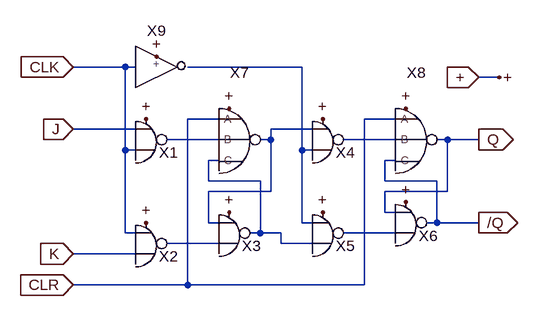
[diagram p0: schematic Jonsson.asc]
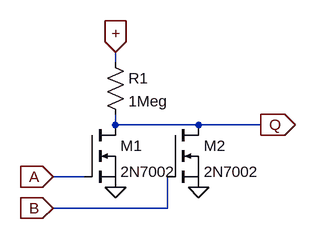
[diagram p1: sub-circuit nor2.asc]
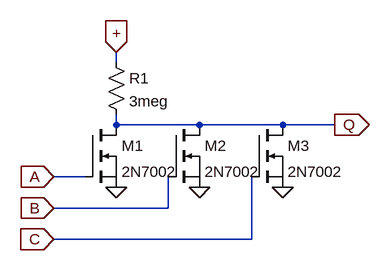
[diagram p2: sub-circuit nor3.asc]
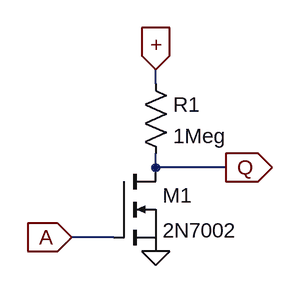
[diagram p3: sub-circuit inv.asc]
Jonsson.asc, the LTspice schematic file:
Version 4
SHEET 1 880 680
WIRE 176 80 96 80
WIRE 192 80 176 80
WIRE 448 80 272 80
WIRE 752 96 720 96
WIRE 320 160 272 160
WIRE 592 160 544 160
WIRE 192 176 96 176
WIRE 464 176 400 176
WIRE 320 192 240 192
WIRE 400 192 400 176
WIRE 400 192 384 192
WIRE 592 192 512 192
WIRE 672 192 656 192
WIRE 720 192 672 192
WIRE 176 208 176 80
WIRE 192 208 176 208
WIRE 448 208 448 80
WIRE 464 208 448 208
WIRE 320 224 304 224
WIRE 592 224 576 224
WIRE 304 256 304 224
WIRE 384 256 304 256
WIRE 576 256 576 224
WIRE 656 256 576 256
WIRE 400 272 400 192
WIRE 400 272 304 272
WIRE 672 272 672 192
WIRE 672 272 576 272
WIRE 576 304 576 272
WIRE 592 304 576 304
WIRE 304 320 304 272
WIRE 320 320 304 320
WIRE 448 320 448 208
WIRE 464 320 448 320
WIRE 656 320 656 256
WIRE 656 320 640 320
WIRE 720 320 656 320
WIRE 176 336 176 208
WIRE 192 336 176 336
WIRE 384 336 384 256
WIRE 384 336 368 336
WIRE 416 336 384 336
WIRE 592 336 512 336
WIRE 320 352 240 352
WIRE 416 352 416 336
WIRE 464 352 416 352
WIRE 192 368 96 368
WIRE 272 416 272 160
WIRE 272 416 96 416
WIRE 544 416 544 160
WIRE 544 416 272 416
FLAG 224 64 +
FLAG 208 160 +
FLAG 208 320 +
FLAG 336 304 +
FLAG 336 144 +
FLAG 480 160 +
FLAG 480 304 +
FLAG 608 288 +
FLAG 608 144 +
FLAG 96 80 CLK
IOPIN 96 80 In
FLAG 96 176 J
IOPIN 96 176 In
FLAG 96 368 K
IOPIN 96 368 In
FLAG 96 416 CLR
IOPIN 96 416 In
FLAG 720 192 Q
IOPIN 720 192 Out
FLAG 720 320 /Q
IOPIN 720 320 Out
FLAG 720 96 +
IOPIN 720 96 In
FLAG 752 96 +
SYMBOL NOR2 224 192 R0
SYMATTR InstName X1
SYMBOL NOR2 224 352 R0
SYMATTR InstName X2
SYMBOL NOR2 352 336 R0
SYMATTR InstName X3
SYMBOL NOR2 496 192 R0
SYMATTR InstName X4
SYMBOL NOR2 496 336 R0
SYMATTR InstName X5
SYMBOL NOR2 624 320 R0
SYMATTR InstName X6
SYMBOL NOR3 352 192 R0
SYMATTR InstName X7
SYMBOL NOR3 624 192 R0
SYMATTR InstName X8
SYMBOL INV 224 80 R0
SYMATTR InstName X9

nor2.asc, the sub-circuit schematic file:
Version 4
SHEET 1 880 680
WIRE 272 144 272 128
WIRE 272 240 272 224
WIRE 400 240 272 240
WIRE 496 240 400 240
WIRE 224 320 176 320
WIRE 352 368 352 320
WIRE 352 368 176 368
FLAG 272 336 0
FLAG 176 320 A
IOPIN 176 320 In
FLAG 496 240 Q
IOPIN 496 240 Out
FLAG 272 128 +
IOPIN 272 128 In
FLAG 400 336 0
FLAG 176 368 B
IOPIN 176 368 In
SYMBOL nmos 224 240 R0
SYMATTR InstName M1
SYMATTR Value 2N7002
SYMBOL res 256 128 R0
SYMATTR InstName R1
SYMATTR Value 1Meg
SYMBOL nmos 352 240 R0
SYMATTR InstName M2
SYMATTR Value 2N7002

nor3.asc, the sub-circuit schematic file:
Version 4
SHEET 1 880 680
WIRE 272 144 272 128
WIRE 272 240 272 224
WIRE 400 240 272 240
WIRE 528 240 400 240
WIRE 608 240 528 240
WIRE 224 320 176 320
WIRE 352 368 352 320
WIRE 352 368 176 368
WIRE 480 416 480 320
WIRE 480 416 176 416
FLAG 272 336 0
FLAG 176 320 A
IOPIN 176 320 In
FLAG 608 240 Q
IOPIN 608 240 Out
FLAG 272 128 +
IOPIN 272 128 In
FLAG 400 336 0
FLAG 528 336 0
FLAG 176 368 B
IOPIN 176 368 In
FLAG 176 416 C
IOPIN 176 416 In
SYMBOL nmos 224 240 R0
SYMATTR InstName M1
SYMATTR Value 2N7002
SYMBOL res 256 128 R0
SYMATTR InstName R1
SYMATTR Value 3meg
SYMBOL nmos 352 240 R0
SYMATTR InstName M2
SYMATTR Value 2N7002
SYMBOL nmos 480 240 R0
SYMATTR InstName M3
SYMATTR Value 2N7002

inv.asc, the sub-circuit schematic file:
Version 4
SHEET 1 880 680
WIRE 272 144 272 128
WIRE 272 240 272 224
WIRE 352 240 272 240
WIRE 224 320 176 320
FLAG 272 336 0
FLAG 176 320 A
IOPIN 176 320 In
FLAG 352 240 Q
IOPIN 352 240 Out
FLAG 272 128 +
IOPIN 272 128 In
SYMBOL nmos 224 240 R0
SYMATTR InstName M1
SYMATTR Value 2N7002
SYMBOL res 256 128 R0
SYMATTR InstName R1
SYMATTR Value 1Meg

The netlist it stands for:
* Jonsson.asc
XX1 + J CLK N003 nor2
XX2 + CLK K N007 nor2
XX3 + N002 N007 N005 nor2
XX4 + N002 N001 N004 nor2
XX5 + N001 N005 N006 nor2
XX6 + Q N006 /Q nor2
XX7 + CLR N003 N005 N002 nor3
XX8 + CLR N004 /Q Q nor3
XX9 + CLK N001 inv

* block symbol definitions
.subckt nor2 + A B Q
M1 Q A 0 0 2N7002
R1 + Q 1Meg
M2 Q B 0 0 2N7002
.ends nor2

.subckt nor3 + A B C Q
M1 Q A 0 0 2N7002
R1 + Q 3meg
M2 Q B 0 0 2N7002
M3 Q C 0 0 2N7002
.ends nor3

.subckt inv + A Q
M1 Q A 0 0 2N7002
R1 + Q 1Meg
.ends inv

.model NMOS NMOS
.model PMOS PMOS
.lib standard.mos
.backanno
.end